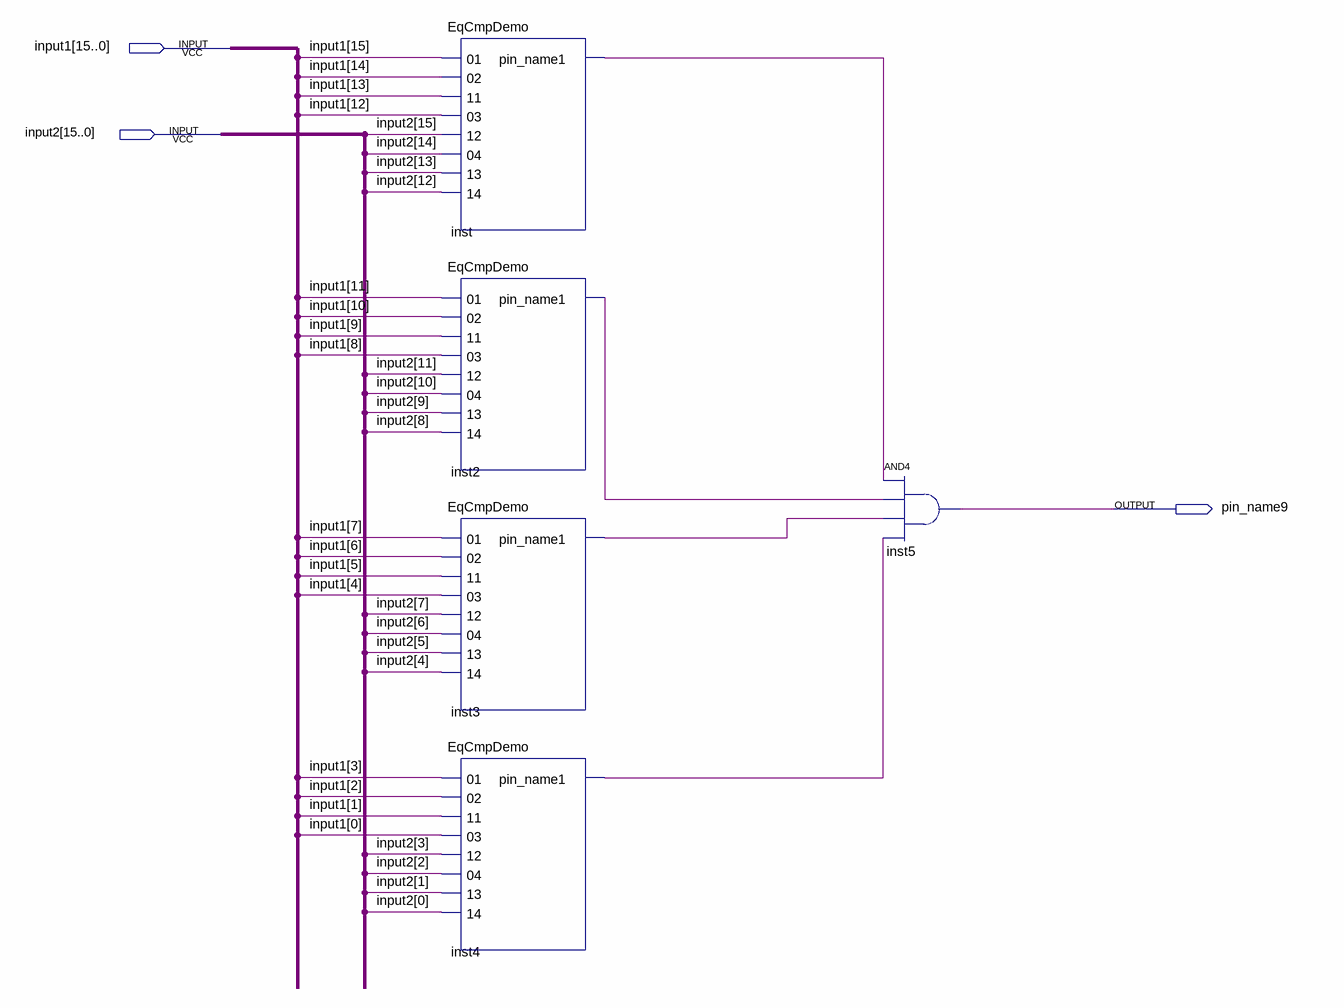
[diagram p0: schematic sheet]
// Quartus schematic Block3.bdf as structural Verilog: 5 symbols, 3 pins
module Block3 (
  input  [15:0] input1,
  input  [15:0] input2,
  output pin_name9
);

  wire inst2_pin_name1, inst3_pin_name1, inst4_pin_name1, inst_pin_name1;

  EqCmpDemo inst (
    .\01 (input1[15]), .\02 (input1[14]), .\11 (input1[13]), .\03 (input1[12]), .\12 (input2[15]),
    .\04 (input2[14]), .\13 (input2[13]), .\14 (input2[12]), .pin_name1(inst_pin_name1));
  EqCmpDemo inst2 (
    .\01 (input1[11]), .\02 (input1[10]), .\11 (input1[9]), .\03 (input1[8]), .\12 (input2[11]),
    .\04 (input2[10]), .\13 (input2[9]), .\14 (input2[8]), .pin_name1(inst2_pin_name1));
  EqCmpDemo inst3 (
    .\01 (input1[7]), .\02 (input1[6]), .\11 (input1[5]), .\03 (input1[4]), .\12 (input2[7]),
    .\04 (input2[6]), .\13 (input2[5]), .\14 (input2[4]), .pin_name1(inst3_pin_name1));
  EqCmpDemo inst4 (
    .\01 (input1[3]), .\02 (input1[2]), .\11 (input1[1]), .\03 (input1[0]), .\12 (input2[3]),
    .\04 (input2[2]), .\13 (input2[1]), .\14 (input2[0]), .pin_name1(inst4_pin_name1));
  and inst5 (pin_name9, inst_pin_name1, inst2_pin_name1, inst3_pin_name1, inst4_pin_name1);
endmodule
